# EAGLE design scope (EAGLE 5.01)
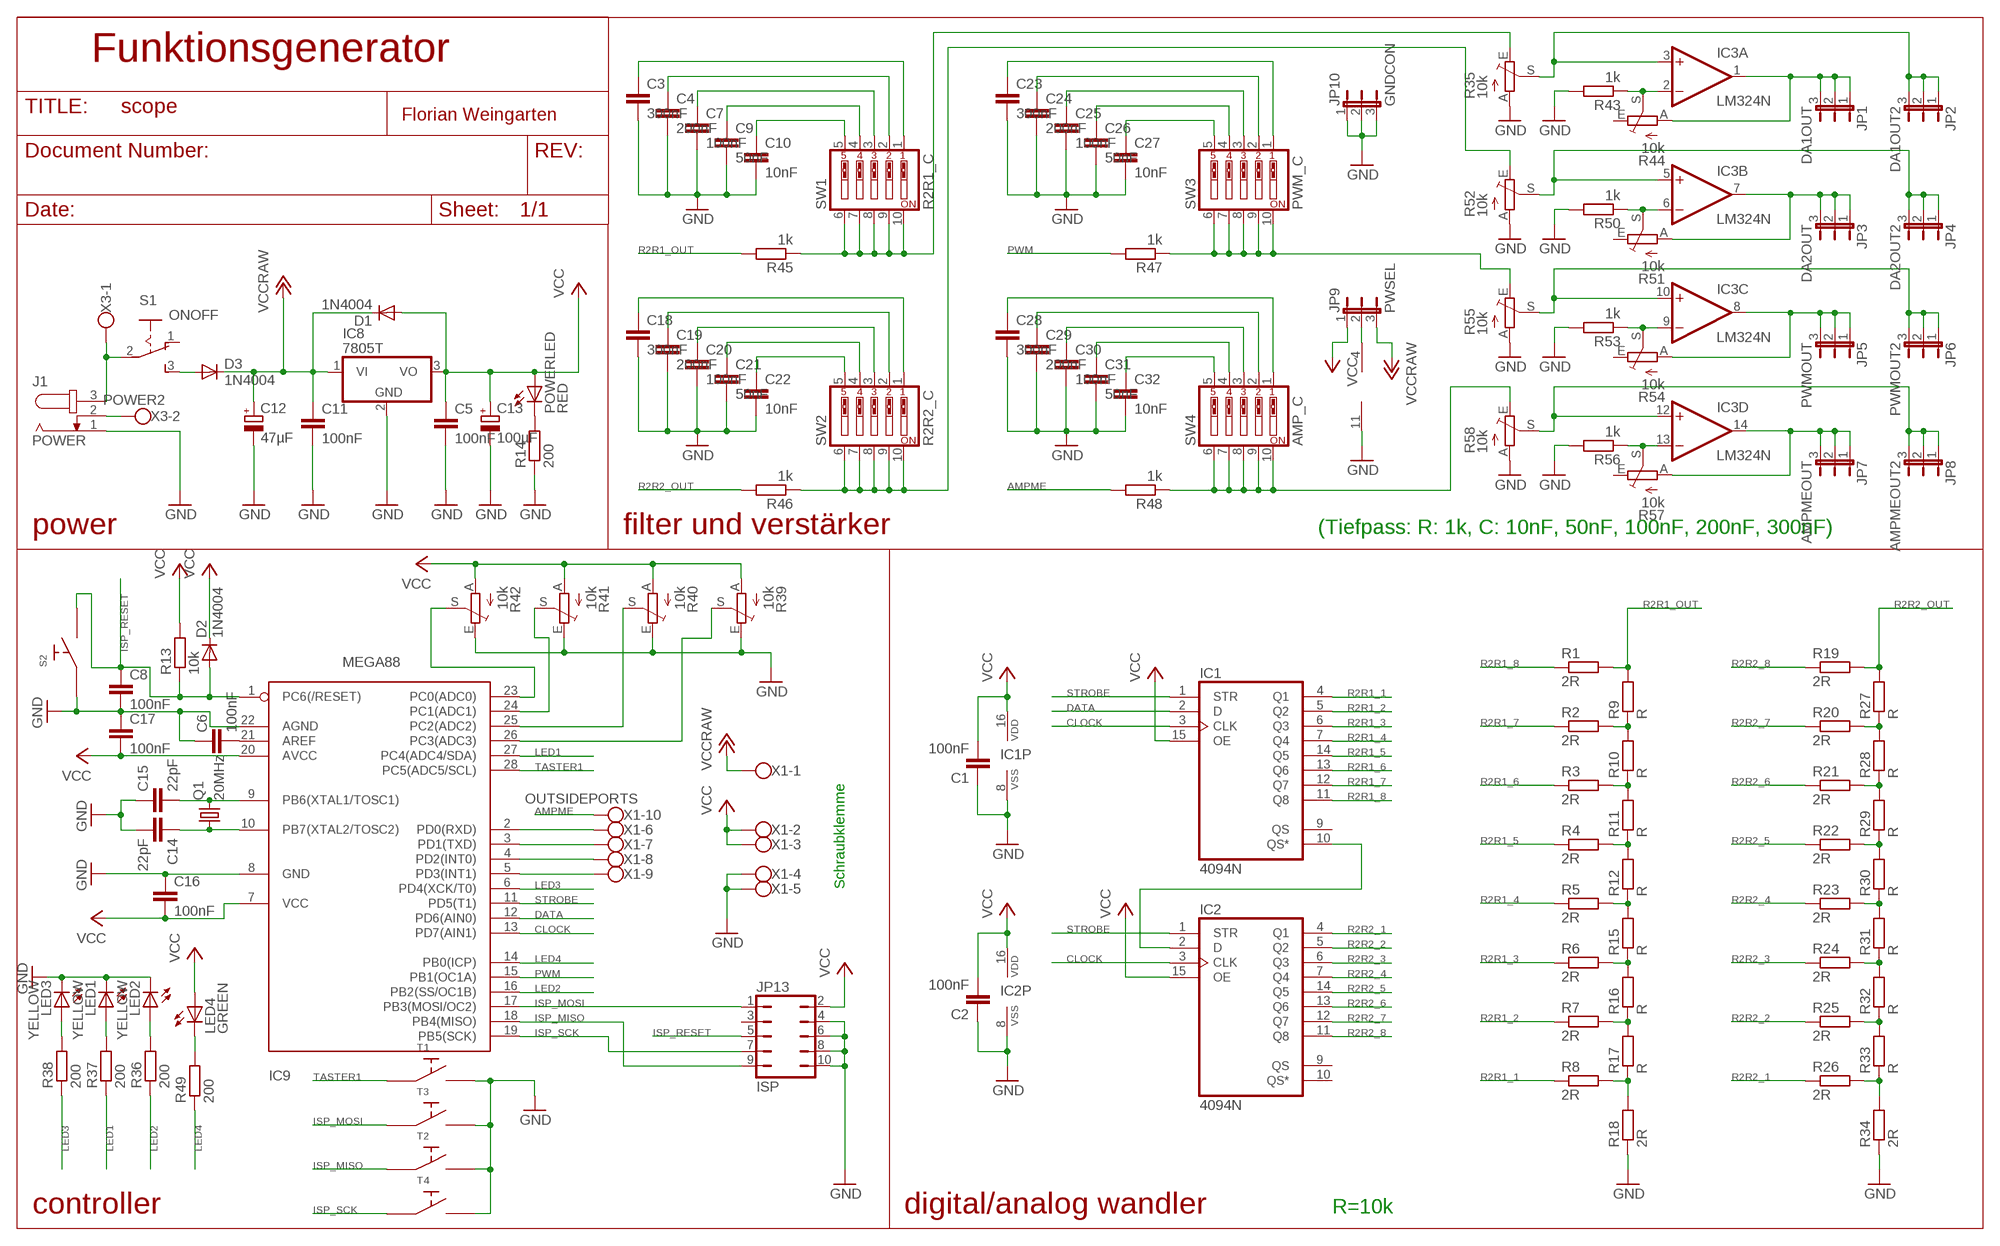
[diagram p0: schematic, sheet 1]

## Parts
C1  100nF  C-EU025-024X044  [C025-024X044]
C2  100nF  C-EU025-024X044  [C025-024X044]
C3  300nF  C-EU025-024X044  [C025-024X044]
C4  200nF  C-EU025-024X044  [C025-024X044]
C5  100nF  C-EU025-024X044  [C025-024X044]
C6  100nF  C-EU025-024X044  [C025-024X044]
C7  100nF  C-EU025-024X044  [C025-024X044]
C8  100nF  C-EU025-024X044  [C025-024X044]
C9  50nF  C-EU025-024X044  [C025-024X044]
C10  10nF  C-EU025-024X044  [C025-024X044]
C11  100nF  C-EU025-024X044  [C025-024X044]
C12  47µF  CPOL-EUE2-5  [E2-5]
C13  100µF  CPOL-EUE2-5  [E2-5]
C14  22pF  C-EU025-025X050  [C025-025X050]
C15  22pF  C-EU025-025X050  [C025-025X050]
C16  100nF  C-EU025-024X044  [C025-024X044]
C17  100nF  C-EU025-024X044  [C025-024X044]
C18  300nF  C-EU025-024X044  [C025-024X044]
C19  200nF  C-EU025-024X044  [C025-024X044]
C20  100nF  C-EU025-024X044  [C025-024X044]
C21  50nF  C-EU025-024X044  [C025-024X044]
C22  10nF  C-EU025-024X044  [C025-024X044]
C23  300nF  C-EU025-024X044  [C025-024X044]
C24  200nF  C-EU025-024X044  [C025-024X044]
C25  100nF  C-EU025-024X044  [C025-024X044]
C26  50nF  C-EU025-024X044  [C025-024X044]
C27  10nF  C-EU025-024X044  [C025-024X044]
C28  300nF  C-EU025-024X044  [C025-024X044]
C29  200nF  C-EU025-024X044  [C025-024X044]
C30  100nF  C-EU025-024X044  [C025-024X044]
C31  50nF  C-EU025-024X044  [C025-024X044]
C32  10nF  C-EU025-024X044  [C025-024X044]
D1  1N4004  DIODE-D-2.5  [D-2.5]
D2  1N4004  DIODE-D-2.5  [D-2.5]
D3  1N4004  DIODE-D-2.5  [D-2.5]
IC1  4094N  [DIL16]
IC2  4094N  [DIL16]
IC3  LM324N  [DIL14]
IC8  7805T  [TO220H]
IC9  MEGA88  MEGA8-P  [DIL28-3]
J1  POWER  JACK-PLUG1  [SPC4078]
JP1  DA1OUT  JP2E  [JP2]
JP2  DA1OUT2  JP2E  [JP2]
JP3  DA2OUT  JP2E  [JP2]
JP4  DA2OUT2  JP2E  [JP2]
JP5  PWMOUT  JP2E  [JP2]
JP6  PWMOUT2  JP2E  [JP2]
JP7  AMPMEOUT  JP2E  [JP2]
JP8  AMPMEOUT2  JP2E  [JP2]
JP9  PWSEL  JP2E  [JP2]
JP10  GNDCON  JP2E  [JP2]
JP13  ISP  JP5Q  [JP5Q]
LED1  YELLOW  LED3MM  [LED3MM]
LED2  YELLOW  LED3MM  [LED3MM]
LED3  YELLOW  LED3MM  [LED3MM]
LED4  GREEN  LED3MM  [LED3MM]
POWERLED  RED  LED3MM  [LED3MM]
Q1  20MHz  CRYSTALHC49S  [HC49/S]
R1  2R  R-EU_0207/2V  [0207/2V]
R2  2R  R-EU_0207/2V  [0207/2V]
R3  2R  R-EU_0207/2V  [0207/2V]
R4  2R  R-EU_0207/2V  [0207/2V]
R5  2R  R-EU_0207/2V  [0207/2V]
R6  2R  R-EU_0207/2V  [0207/2V]
R7  2R  R-EU_0207/2V  [0207/2V]
R8  2R  R-EU_0207/2V  [0207/2V]
R9  R  R-EU_0207/2V  [0207/2V]
R10  R  R-EU_0207/2V  [0207/2V]
R11  R  R-EU_0207/2V  [0207/2V]
R12  R  R-EU_0207/2V  [0207/2V]
R13  10k  R-EU_0207/2V  [0207/2V]
R14  200  R-EU_0207/2V  [0207/2V]
R15  R  R-EU_0207/2V  [0207/2V]
R16  R  R-EU_0207/2V  [0207/2V]
R17  R  R-EU_0207/2V  [0207/2V]
R18  2R  R-EU_0207/2V  [0207/2V]
R19  2R  R-EU_0207/2V  [0207/2V]
R20  2R  R-EU_0207/2V  [0207/2V]
R21  2R  R-EU_0207/2V  [0207/2V]
R22  2R  R-EU_0207/2V  [0207/2V]
R23  2R  R-EU_0207/2V  [0207/2V]
R24  2R  R-EU_0207/2V  [0207/2V]
R25  2R  R-EU_0207/2V  [0207/2V]
R26  2R  R-EU_0207/2V  [0207/2V]
R27  R  R-EU_0207/2V  [0207/2V]
R28  R  R-EU_0207/2V  [0207/2V]
R29  R  R-EU_0207/2V  [0207/2V]
R30  R  R-EU_0207/2V  [0207/2V]
R31  R  R-EU_0207/2V  [0207/2V]
R32  R  R-EU_0207/2V  [0207/2V]
R33  R  R-EU_0207/2V  [0207/2V]
R34  2R  R-EU_0207/2V  [0207/2V]
R35  10k  TRIM_EU-PT10  [PT-10]
R36  200  R-EU_0207/2V  [0207/2V]
R37  200  R-EU_0207/2V  [0207/2V]
R38  200  R-EU_0207/2V  [0207/2V]
R39  10k  TRIM_EU-PT10  [PT-10]
R40  10k  TRIM_EU-PT10  [PT-10]
R41  10k  TRIM_EU-PT10  [PT-10]
R42  10k  TRIM_EU-PT10  [PT-10]
R43  1k  R-EU_0207/2V  [0207/2V]
R44  10k  TRIM_EU-PT10  [PT-10]
R45  1k  R-EU_0207/2V  [0207/2V]
R46  1k  R-EU_0207/2V  [0207/2V]
R47  1k  R-EU_0207/2V  [0207/2V]
R48  1k  R-EU_0207/2V  [0207/2V]
R49  200  R-EU_0207/2V  [0207/2V]
R50  1k  R-EU_0207/2V  [0207/2V]
R51  10k  TRIM_EU-PT10  [PT-10]
R52  10k  TRIM_EU-PT10  [PT-10]
R53  1k  R-EU_0207/2V  [0207/2V]
R54  10k  TRIM_EU-PT10  [PT-10]
R55  10k  TRIM_EU-PT10  [PT-10]
R56  1k  R-EU_0207/2V  [0207/2V]
R57  10k  TRIM_EU-PT10  [PT-10]
R58  10k  TRIM_EU-PT10  [PT-10]
S1  ONOFF  255SB  [255SB]
S2  MIKROTASTER6X6L  [TASTER3301]
SW1  R2R1_C  SW_DIP-5  [EDG-05]
SW2  R2R2_C  SW_DIP-5  [EDG-05]
SW3  PWM_C  SW_DIP-5  [EDG-05]
SW4  AMP_C  SW_DIP-5  [EDG-05]
T1  MIKROTASTER6X6L  [TASTER3301]
T2  MIKROTASTER6X6L  [TASTER3301]
T3  MIKROTASTER6X6L  [TASTER3301]
T4  MIKROTASTER6X6L  [TASTER3301]
X1  OUTSIDEPORTS  W237-10P  [W237-10P]
X3  POWER2  W237-02P  [W237-132]

## Nets
+12V: C11.1 C12.+ D1.C D3.C IC8.1(VI) JP9.3 X1.1 ; supply symbol labelled VCCRAW
AMPME: R48.2 X1.10
CLOCK: IC1.3(CLK) IC2.3(CLK) IC9.13(PD7(AIN1))
DATA: IC1.2(D) IC9.12(PD6(AIN0))
GND: C1.1 C2.1 C3.2 C4.2 C5.2 C6.1 C7.2 C8.2 C9.2 C10.2 C11.2 C12.- C13.- C14.2 C15.1 C16.1 C17.1 C18.2 C19.2 C20.2 C21.2 C22.2 C23.2 C24.2 C25.2 C26.2 C27.2 C28.2 C29.2 C30.2 C31.2 C32.2 IC1.8(VSS) IC2.8(VSS) IC3.11(P:V-) IC8.2(GND) IC9.8(GND) IC9.22(AGND) J1.1 JP10.1 JP10.2 JP10.3 JP13.4 JP13.6 JP13.8 JP13.10 LED1.K(C) LED2.K(C) LED3.K(C) R14.1 R18.1 R34.1 R35.A R39.E R40.E R41.E R42.E R43.2 R50.2 R52.A R53.2 R55.A R56.2 R58.A S2.1 T1.2 T2.2 T3.2 T4.2 X1.4 X1.5
ISP_MISO: IC9.18(PB4(MISO)) JP13.9 T2.1
ISP_MOSI: IC9.17(PB3(MOSI/OC2)) JP13.1 T3.1
ISP_RESET: C8.1 D2.A IC9.1(PC6(/RESET)) JP13.5 R13.1 S2.2
ISP_SCK: IC9.19(PB5(SCK)) JP13.7 T4.1
LED1: IC9.27(PC4(ADC4/SDA)) R37.1
LED2: IC9.16(PB2(SS/OC1B)) R36.1
LED3: IC9.6(PD4(XCK/T0)) R38.1
LED4: IC9.14(PB0(ICP)) R49.1
N$1: R2.2 R9.1 R10.2
N$2: R3.2 R10.1 R11.2
N$3: R4.2 R11.1 R12.2
N$4: R5.2 R12.1 R15.2
N$5: R6.2 R15.1 R16.2
N$6: IC3.3(A:+IN) JP2.1 JP2.2 JP2.3 R35.S
N$7: R7.2 R16.1 R17.2
N$8: IC1.10(QS*) IC2.2(D)
N$9: R8.2 R17.1 R18.2
N$10: R20.2 R27.1 R28.2
N$11: R21.2 R28.1 R29.2
N$12: R22.2 R29.1 R30.2
N$13: IC3.14(D:OUT) JP7.1 JP7.2 JP7.3 R57.A
N$14: R24.2 R31.1 R32.2
N$15: R25.2 R32.1 R33.2
N$16: C10.1 SW1.5
N$17: R26.2 R33.1 R34.2
N$18: C9.1 SW1.4
N$19: C7.1 SW1.3
N$20: C4.1 SW1.2
N$21: C3.1 SW1.1
N$22: IC9.2(PD0(RXD)) X1.6
N$23: IC9.3(PD1(TXD)) X1.7
N$24: IC9.4(PD2(INT0)) X1.8
N$25: IC9.5(PD3(INT1)) X1.9
N$26: POWERLED.K(C) R14.2
N$27: IC9.23(PC0(ADC0)) R42.S
N$28: LED3.A R38.2
N$29: LED1.A R37.2
N$30: LED2.A R36.2
N$31: IC3.2(A:-IN) R43.1 R44.S
N$32: IC3.1(A:OUT) JP1.1 JP1.2 JP1.3 R44.A
N$33: IC9.24(PC1(ADC1)) R41.S
N$35: IC9.26(PC3(ADC3)) R39.S
N$36: LED4.K(C) R49.2
N$37: C22.1 SW2.5
N$38: C21.1 SW2.4
N$39: C20.1 SW2.3
N$40: C19.1 SW2.2
N$41: C18.1 SW2.1
N$42: C27.1 SW3.5
N$43: C26.1 SW3.4
N$44: C25.1 SW3.3
N$45: C24.1 SW3.2
N$46: C23.1 SW3.1
N$47: C32.1 SW4.5
N$48: C31.1 SW4.4
N$49: C30.1 SW4.3
N$50: C29.1 SW4.2
N$51: C28.1 SW4.1
N$52: IC3.6(B:-IN) R50.1 R51.S
N$53: IC3.7(B:OUT) JP3.1 JP3.2 JP3.3 R51.A
N$54: IC3.5(B:+IN) JP4.1 JP4.2 JP4.3 R52.S
N$55: IC3.9(C:-IN) R53.1 R54.S
N$56: IC3.8(C:OUT) JP5.1 JP5.2 JP5.3 R54.A
N$57: IC3.10(C:+IN) JP6.1 JP6.2 JP6.3 R55.S
N$58: IC3.13(D:-IN) R56.1 R57.S
N$59: IC3.12(D:+IN) JP8.1 JP8.2 JP8.3 R58.S
N$61: IC3.4(P:V+) JP9.2
N$62: R35.E R45.1 SW1.6 SW1.7 SW1.8 SW1.9 SW1.10
N$63: R46.1 R52.E SW2.6 SW2.7 SW2.8 SW2.9 SW2.10
N$65: R48.1 R58.E SW4.6 SW4.7 SW4.8 SW4.9 SW4.10
N$68: R47.1 R55.E SW3.6 SW3.7 SW3.8 SW3.9 SW3.10
N$69: J1.3 S1.2(P) X3.1
N$70: J1.2 X3.2
N$71: D3.A S1.3(S)
N$72: IC9.25(PC2(ADC2)) R40.S
N$73: R23.2 R30.1 R31.2
N$75: C15.2 IC9.9(PB6(XTAL1/TOSC1)) Q1.2
N$76: C14.1 IC9.10(PB7(XTAL2/TOSC2)) Q1.1
N$101: C6.2 IC9.21(AREF)
PWM: IC9.15(PB1(OC1A)) R47.2
R2R1_1: IC1.4(Q1) R8.1
R2R1_2: IC1.5(Q2) R7.1
R2R1_3: IC1.6(Q3) R6.1
R2R1_4: IC1.7(Q4) R5.1
R2R1_5: IC1.14(Q5) R4.1
R2R1_6: IC1.13(Q6) R3.1
R2R1_7: IC1.12(Q7) R2.1
R2R1_8: IC1.11(Q8) R1.1
R2R1_OUT: R1.2 R9.2 R45.2
R2R2_1: IC2.4(Q1) R26.1
R2R2_2: IC2.5(Q2) R25.1
R2R2_3: IC2.6(Q3) R24.1
R2R2_4: IC2.7(Q4) R23.1
R2R2_5: IC2.14(Q5) R22.1
R2R2_6: IC2.13(Q6) R21.1
R2R2_7: IC2.12(Q7) R20.1
R2R2_8: IC2.11(Q8) R19.1
R2R2_OUT: R19.2 R27.2 R46.2
STROBE: IC1.1(STR) IC2.1(STR) IC9.11(PD5(T1))
TASTER1: IC9.28(PC5(ADC5/SCL)) T1.1
VCC: C1.2 C2.2 C5.1 C13.+ C16.2 C17.2 D1.A D2.C IC1.15(OE) IC1.16(VDD) IC2.15(OE) IC2.16(VDD) IC8.3(VO) IC9.7(VCC) IC9.20(AVCC) JP9.1 JP13.2 LED4.A POWERLED.A R13.2 R39.A R40.A R41.A R42.A X1.2 X1.3
Unconnected: IC1.9(QS) IC2.9(QS) IC2.10(QS*) JP13.3 R44.E R51.E R54.E R57.E S1.1(O)

## Notes on the sheet
- Funktionsgenerator
- Florian Weingarten
- power | filter und verstärker | (Tiefpass: R: 1k, C: 10nF, 50nF, 100nF, 200nF, 300nF)
- Schraubklemme
- controller | digital/analog wandler | R=10k

## Library data of the parts
C1-C11 C14-C32 = rcl:C-EU: CAPACITOR, European symbol
C12 C13 = rcl:CPOL-EU: POLARIZED CAPACITOR, European symbol
D1-D3 = diode:DIODE-: DIODE
IC1 IC2 = 40xx:4094: 8-stage SHIFT/STORE REGISTER, tri-state
IC3 = linear:LM324: OP AMP
IC8 = linear:78*: Positive VOLTAGE REGULATOR Source: http://cache.national.com/ds/LM/LM78L05.pdf http://www.fairchildsemi.com/ds/LM/LM7805.pdf
IC9 = atmel:MEGA8-P: MICROCONTROLLER 8 Kbytes FLASH, 1 kbytes SRAM, 512 bytes EEPROM, USART, 4-channel 10 bit ADC, 2-channel 8 bit ADC Pin compatible with Atmega48, ATMega88, ATMega168 Source: avr.lbr
J1 = con-jack:JACK-PLUG: DC POWER JACK Power Jack, DC, Right Angle, Through Hole, Rated 5A at 16VDC, PC Terminals Distributor: Farnell (www.Farnell.de) Drawing: 84N1161.pdf / 84N1162.pdf Manufacturer: SPC Technology (www.spctechnology.com) Type: SPC4077 / SPC 4078
JP1-JP10 = jumper:JP2E: JUMPER
JP13 = jumper:JP5Q: JUMPER
LED1-LED4 POWERLED = led:LED: LED OSRAM: - CHIPLED LG R971, LG N971, LY N971, LG Q971, LY Q971, LO R971, LY R971 LH N974, LH R974 LS Q976, LO Q976, LY Q976 LO Q996 - Hyper CHIPLED LW Q18S LB Q993, LB Q99A, LB R99A - SideLED LS A670, LO A670, LY A670, LG A670, LP A670 LB A673, LV A673, LT A673, LW A673 LH A674 LY A675 LS A676, LA A676, LO A676, LY A676, LW A676 LS A679, LY A679, LG A679 - Hyper Micro SIDELED® LS Y876, LA Y876, LO Y876, LY Y876 LT Y87S - SmartLED LW L88C, LW L88S LB L89C, LB L89S, LG L890 LS L89K, LO L89K, LY L89K LS L896, LA L896, LO L896, LY L896 - TOPLED LS T670, LO T670, LY T670, LG T670, LP T670 LSG T670, LSP T670, LSY T670, LOP T670, LYG T670 LG T671, LOG T671, LSG T671 LB T673, LV T673, LT T673, LW T673 LH T674 LS T676, LA T676, LO T676, LY T676, LB T676, LH T676, LSB T676, LW T676 LB T67C, LV T67C, LT T67C, LS T67K, LO T67K, LY T67K, LW E67C LS E67B, LA E67B, LO E67B, LY E67B, LB E67C, LV E67C, LT E67C LW T67C LS T679, LY T679, LG T679 LS T770, LO T770, LY T770, LG T770, LP T770 LB T773, LV T773, LT T773, LW T773 LH T774 LS E675, LA E675, LY E675, LS T675 LS T776, LA T776, LO T776, LY T776, LB T776 LHGB T686 LT T68C, LB T68C - Hyper Mini TOPLED® LB M676 - Mini TOPLED Santana® LG M470 LS M47K, LO M47K, LY M47K Source: http://www.osram.convergy.de - LUMILED® LXK2-PW12-R00, LXK2-PW12-S00, LXK2-PW14-U00, LXK2-PW14-V00 LXK2-PM12-R00, LXK2-PM12-S00, LXK2-PM14-U00 LXK2-PE12-Q00, LXK2-PE12-R00, LXK2-PE12-S00, LXK2-PE14-T00, LXK2-PE14-U00 LXK2-PB12-K00, LXK2-PB12-L00, LXK2-PB12-M00, LXK2-PB14-N00, LXK2-PB14-P00, LXK2-PB14-Q00 LXK2-PR12-L00, LXK2-PR12-M00, LXK2-PR14-Q00, LXK2-PR14-R00 LXK2-PD12-Q00, LXK2-PD12-R00, LXK2-PD12-S00 LXK2-PH12-R00, LXK2-PH12-S00 LXK2-PL12-P00, LXK2-PL12-Q00, LXK2-PL12-R00 Source: www.luxeon.com
Q1 = crystal:CRYSTAL: CRYSTAL
R1-R34 R36-R38 R43 R45-R50 R53 R56 = rcl:R-EU_: RESISTOR, European symbol
R35 R39-R42 R44 R51 R52 R54 R55 R57 R58 = pot:TRIM_EU-: POTENTIOMETER
S1 = switch:255SB: SLIDING SWITCH Distributor Buerklin, 11G810
S2 T1-T4 = reichelt:MIKROTASTER
SW1-SW4 = special:SW_DIP-5: DIP SWITCH
X1 = con-wago-508:W237-10P: WAGO SREW CLAMP
X3 = con-wago-508:W237-02P: WAGO SREW CLAMP

## Board
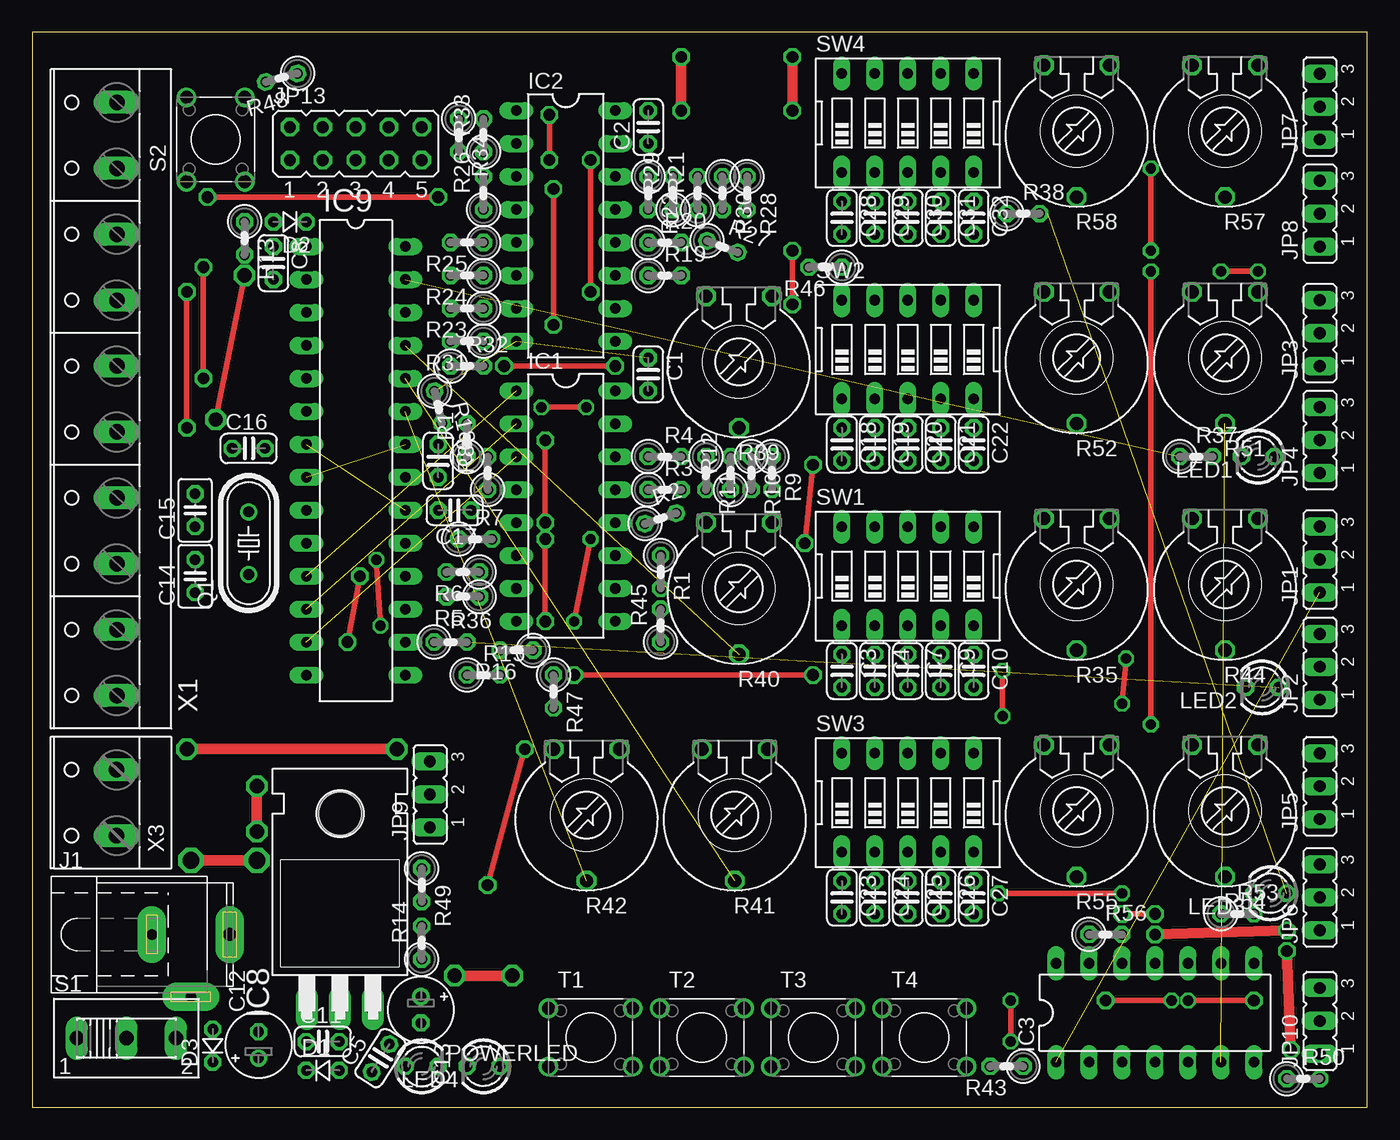
[diagram p1: board, top side]
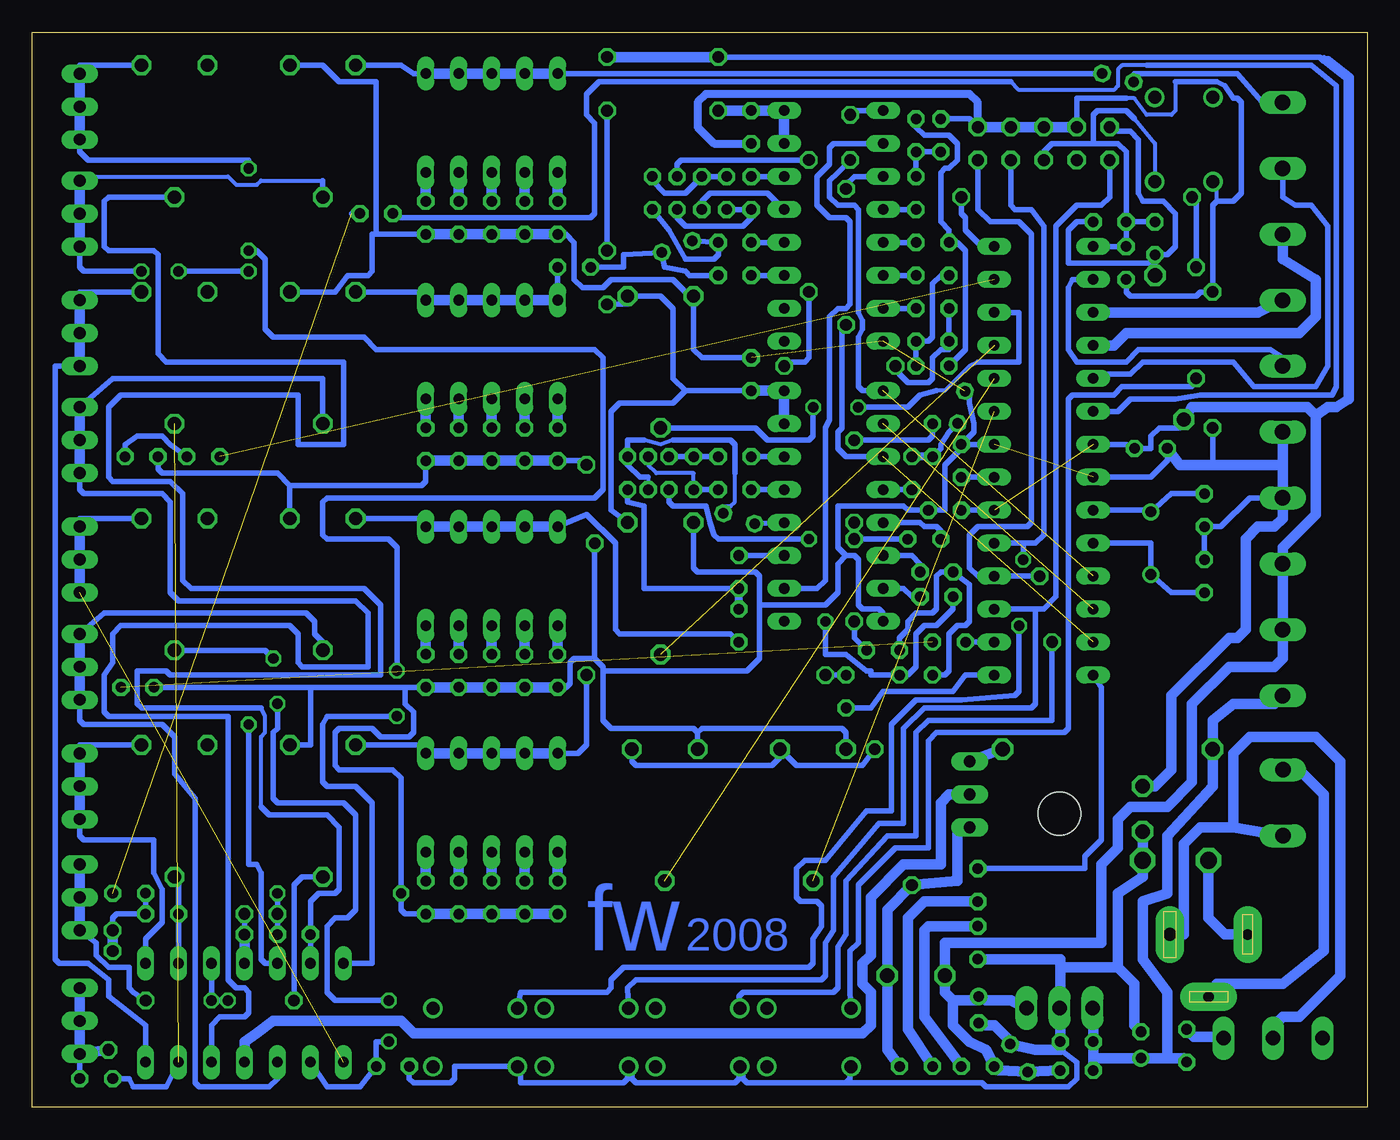
[diagram p2: board, bottom side, seen from below]

Size 102.86 x 82.86 mm. Coordinates in mm from the lower left corner, seen from the top.
Outline: 0,0 102.86,0 102.86,82.86 0,82.86 0,0
Copper layers (1*16): Top 0.035mm / dielectric 1.5mm / Bottom 0.035mm
Design rules "default": minimum track width 10mil, minimum drill 24mil, track to track 8mil, track to pad 8mil, pad to pad 8mil, via to via 8mil, smd to smd 8mil, copper to edge 40mil, drill to drill 8mil, minimum pad ring 10mil, minimum via ring 8mil, stop-mask expansion 4mil, vias tented up to drill 0mil, thermal gap 10mil

### Footprints (pad centres in the part's own frame; a part is rotated, then mirrored left to right if it is on the bottom)
C025-024X044 = drill 0.813 octagon: 1 -1.27,0; 2 1.27,0
E2-5 = drill 0.813 pad 1.27 round: + -1.016,0 | drill 0.813 pad 1.27 octagon: - 1.016,0
C025-025X050 = drill 0.813 octagon: 1 -1.27,0; 2 1.27,0
D-2.5 = drill 0.813 octagon: A 1.27,0; C -1.27,0
DIL16 = drill 0.813 long: 1 -8.89,-3.81; 2 -6.35,-3.81; 3 -3.81,-3.81; 4 -1.27,-3.81; 5 1.27,-3.81; 6 3.81,-3.81; 7 6.35,-3.81; 8 8.89,-3.81; 9 8.89,3.81; 10 6.35,3.81; 11 3.81,3.81; 12 1.27,3.81; 13 -1.27,3.81; 14 -3.81,3.81; 15 -6.35,3.81; 16 -8.89,3.81
DIL14 = drill 0.813 long: 1 -7.62,-3.81; 2 -5.08,-3.81; 3 -2.54,-3.81; 4 0,-3.81; 5 2.54,-3.81; 6 5.08,-3.81; 7 7.62,-3.81; 8 7.62,3.81; 9 5.08,3.81; 10 2.54,3.81; 11 0,3.81; 12 -2.54,3.81; 13 -5.08,3.81; 14 -7.62,3.81
TO220H = drill 1.118 long: 1 -2.54,-10.16; 2 0,-10.16; 3 2.54,-10.16 | hole 3.302: 0,4.826
DIL28-3 = drill 0.813 long: 1 -16.51,-3.81; 2 -13.97,-3.81; 3 -11.43,-3.81; 4 -8.89,-3.81; 5 -6.35,-3.81; 6 -3.81,-3.81; 7 -1.27,-3.81; 8 1.27,-3.81; 9 3.81,-3.81; 10 6.35,-3.81; 11 8.89,-3.81; 12 11.43,-3.81; 13 13.97,-3.81; 14 16.51,-3.81; 15 16.51,3.81; 16 13.97,3.81; 17 11.43,3.81; 18 8.89,3.81; 19 6.35,3.81; 20 3.81,3.81; 21 1.27,3.81; 22 -1.27,3.81; 23 -3.81,3.81; 24 -6.35,3.81; 25 -8.89,3.81; 26 -11.43,3.81; 27 -13.97,3.81; 28 -16.51,3.81
SPC4078 = drill 0.8 pad 2.184 long: 1 -3,0; 2 0,-4.8 | drill 1 pad 2.184 long: 3 3,0
JP2 = drill 0.914 long: 1 -2.54,0; 2 0,0; 3 2.54,0
JP5Q = drill 0.914 octagon: 1 -5.08,-1.27; 2 -5.08,1.27; 3 -2.54,-1.27; 4 -2.54,1.27; 5 0,-1.27; 6 0,1.27; 7 2.54,-1.27; 8 2.54,1.27; 9 5.08,-1.27; 10 5.08,1.27
LED3MM = drill 0.813 octagon: A -1.27,0; K 1.27,0
HC49/S = drill 0.813 round: 1 -2.413,0; 2 2.413,0
0207/2V = drill 0.813 octagon: 1 -1.27,0; 2 1.27,0
PT-10 = drill 1.016 octagon: A -2.54,-5.08; E 2.54,-5.08; S 0,5.08
255SB = drill 1.118 long: 1 -3.81,0; 2 0,0; 3 3.81,0
TASTER3301 = drill 1 round: 1 -3.25,2.25; 2 -3.25,-2.25; 3 3.25,-2.25; 4 3.25,2.25
EDG-05 = drill 0.813 long: 1 -5.08,-3.81; 2 -2.54,-3.81; 3 0,-3.81; 4 2.54,-3.81; 5 5.08,-3.81; 6 5.08,3.81; 7 2.54,3.81; 8 0,3.81; 9 -2.54,3.81; 10 -5.08,3.81
W237-10P = drill 1.194 long: 1 -22.86,-0.635; 2 -17.78,-0.635; 3 -12.7,-0.635; 4 -7.62,-0.635; 5 -2.54,-0.635; 6 2.54,-0.635; 7 7.62,-0.635; 8 12.7,-0.635; 9 17.78,-0.635; 10 22.86,-0.635
W237-132 = drill 1.194 long: 1 -2.54,-0.635; 2 2.54,-0.635

### Placement (x,y rotation side)
C1  47.46,56.51 270 top
C2  47.46,75.56 90 top
C3  62.38,33.65 270 top
C4  64.92,33.65 270 top
C5  26.82,3.8 57.7 top
C6  31.27,49.84 270 top
C7  67.46,33.65 270 top
C8  18.57,65.08 270 top
C9  70,33.65 270 top
C10  72.54,33.65 270 top
C11  22.38,5.07 0 top
C12  17.42,4.82 90 top
C13  29.94,7.53 270 top
C14  12.54,40.95 90 top
C15  12.54,46.03 90 top
C16  16.66,50.8 0 top
C17  32.54,46.03 180 top
C18  62.38,51.11 270 top
C19  64.92,51.11 270 top
C20  67.46,51.11 270 top
C21  70,51.11 270 top
C22  72.54,51.11 270 top
C23  62.38,16.19 270 top
C24  64.92,16.19 270 top
C25  67.46,16.19 270 top
C26  70,16.19 270 top
C27  72.54,16.19 270 top
C28  62.38,68.58 270 top
C29  64.92,68.58 270 top
C30  67.46,68.58 270 top
C31  70,68.58 270 top
C32  72.54,68.58 270 top
D1  22.38,2.85 0 top
D2  19.84,68.26 180 top
D3  13.89,4.75 90 top
IC1  41.11,46.35 270 top
IC2  41.11,67.94 270 top
IC3  86.51,7.3 0 top
IC8  23.7,17.83 0 top
IC9  24.92,49.84 270 top
J1  12.21,13.33 0 top
JP1  99.21,42.22 90 top
JP2  99.21,33.97 90 top
JP3  99.21,59.68 90 top
JP4  99.21,51.43 90 top
JP5  99.21,24.76 90 top
JP6  99.21,16.19 90 top
JP7  99.21,77.15 90 top
JP8  99.21,68.89 90 top
JP9  30.63,24.12 90 top
JP10  99.21,6.66 90 top
JP13  24.92,74.29 0 top
LED1  94.45,50.16 180 top
LED2  94.77,32.38 180 top
LED3  95.4,16.5 180 top
LED4  34.76,3.17 180 top
POWERLED  30,3.17 0 top
Q1  16MHz  [HC49/S]  16.66,43.49 90 top
R1  48.41,41.27 270 top
R2  48.41,45.4 18.5 top
R3  48.73,47.62 0 top
R4  48.73,50.16 0 top
R5  33.17,39.37 180 top
R6  33.17,41.27 180 top
R7  34.12,43.81 0 top
R8  35.08,48.89 90 top
R9  56.98,48.89 270 top
R10  55.4,48.89 270 top
R11  51.91,48.89 270 top
R12  53.81,48.89 90 top
R13  16.34,66.99 270 top
R14  30,12.7 90 top
R15  34.76,33.33 0 top
R16  37.3,35.24 180 top
R17  33.49,51.43 90 top
R18  31.27,53.97 282.6 top
R19  48.73,64.13 0 top
R20  48.73,66.67 0 top
R21  51.27,70.48 90 top
R22  47.46,70.48 270 top
R23  33.49,61.59 180 top
R24  33.49,64.13 180 top
R25  33.49,66.67 180 top
R26  34.76,70.48 90 top
R27  53.17,66.35 339 top
R28  55.08,70.48 270 top
R29  49.37,70.48 90 top
R30  53.17,70.48 270 top
R31  33.49,59.05 180 top
R32  33.49,57.14 0 top
R33  34.76,74.93 90 top
R34  32.86,74.93 270 top
R35  80.48,40.32 180 top
R36  32.22,35.87 0 top
R37  89.69,50.16 0 top
R38  76.35,68.89 0 top
R39  54.45,57.46 180 top
R40  54.45,40 180 top
R41  54.13,22.54 180 top
R42  42.7,22.54 180 top
R43  75.08,3.17 180 top
R44  91.91,40.32 180 top
R45  48.41,37.14 90 top
R46  61.11,64.77 180 top
R47  40.16,32.06 270 top
R48  19.2,79.37 195.3 top
R49  30,17.14 270 top
R50  97.94,2.22 0 top
R51  91.91,57.78 180 top
R52  80.48,57.78 180 top
R53  92.86,14.92 0 top
R54  91.91,22.85 180 top
R55  80.48,22.85 180 top
R56  82.7,13.33 0 top
R57  91.91,75.24 180 top
R58  80.48,75.24 180 top
S1  7.24,5.34 0 top
S2  14.12,74.61 90 top
SW1  67.46,40.95 0 top
SW2  67.46,58.41 0 top
SW3  67.46,23.49 0 top
SW4  67.46,75.88 0 top
T1  43.02,5.39 0 top
T2  51.59,5.39 0 top
T3  60.16,5.39 0 top
T4  68.73,5.39 0 top
X1  5.87,54.6 90 top
X3  5.86,23.49 90 top

### Tracks (layer width: path | path; a pad name or v marks a point on that pad's centre or on a via)
+12V  (via drill 1.1)
  Top 0.813: v11.9,27.62 v28.09,27.62
  Bottom 0.813: IC8.1 21.11,6.98 21.11,4.44 | 21.11,4.44 C11.1 | 21.11,3.8 D1.C | 21.11,3.8 21.11,4.44 | 21.11,3.8 C12.+ arc-63 17.3,3.8 15.39,3.8 | X1.1 7.14,31.11 10.31,31.11 11.9,29.84 v11.9,27.62 11.9,24.76 15.39,20.95 15.39,16.5 17.3,15.87 17.3,11.43 15.39,8.88 15.39,3.8 | D3.C 14.12,3.8 15.39,3.8 | v28.09,27.62 JP9.3
AMPME
  Bottom 0.406: X1.10 8.09,77.47 9.99,79.69 17.93,79.69 R48.2
CLOCK  (via drill 0.9)  (1 unrouted)
  Top 0.406: v40.16,60.32 v40.16,70.8
  Bottom 0.406: IC1.3 40.16,50.16 40.79,50.8 40.79,52.06 40.48,52.38 40.48,53.02 40.48,60 v40.16,60.32 | v40.16,70.8 40.16,71.12 39.52,71.75 IC2.3
DATA  (1 unrouted)
GND  (via drill 0.8, 0.9, 1.1, 1.3)  (3 unrouted)
  Top 0.406: v83.97,14.92 v86.51,14.92 | v11.9,52.38 v11.9,62.86 | v59.52,43.49 v60.16,49.52 | v74.45,16.5 v83.97,16.5
  Top 0.813: v12.22,19.04 v17.3,19.04 | v17.3,21.27 v17.3,24.76 | v86.51,13.33 v96.67,13.65 | v96.67,12.06 v96.99,4.44
  Bottom 0.305: 11.58,69.84 11.58,71.12 S2.1 | 18.57,77.78 17.93,77.78 16.98,76.51 15.07,76.51 14.76,76.83 14.76,79.05 | 9.36,13.33 9.04,13.33
  Bottom 0.406: C14.2 C15.1 11.26,44.76 9.04,46.98 X1.4 | IC9.8 16.66,48.57 15.39,49.84 C16.1 | C6.1 IC9.22 | C6.1 31.27,50.8 32.54,49.52 32.54,46.03 C17.1 35.39,46.03 35.71,46.35 40.79,46.35 40.79,43.17 40.16,42.54 | JP13.4 22.38,77.78 18.57,77.78 | T1.2 39.84,2.54 39.84,2.22 40.16,1.9 | 40.16,1.9 47.78,1.9 48.09,2.22 48.09,2.85 T2.2 48.41,2.54 48.41,2.22 48.73,1.9 56.35,1.9 56.67,2.22 56.67,2.85 T3.2 56.98,2.22 57.3,1.9 65.24,1.9 65.24,3.17 | 65.24,3.17 T4.2 | R56.2 v83.97,14.92 v83.97,16.5 | v86.51,14.92 v86.51,13.33 | v96.67,13.65 96.67,14.6 96.36,14.92 R53.2 LED3.K | JP10.1 R50.2 | R43.2 73.81,2.22 73.5,1.9 70.64,1.9 70.32,2.22 70.32,3.17 65.24,3.17 | JP13.10 30.63,76.2 R34.1 | 11.9,49.52 v11.9,52.38 | C8.2 18.57,62.86 18.25,62.54 13.17,62.54 12.85,62.86 v11.9,62.86 11.9,69.53 11.58,69.84 10.31,69.84 9.68,70.48 9.68,77.47 9.99,77.78 10.31,77.78 10.95,78.73 11.58,79.05 14.76,79.05 | 23.65,4.44 22.38,3.49 22.38,2.22 23.01,1.58 29.36,1.58 29.68,1.9 40.16,1.9 | 40.16,42.54 39.52,42.54 39.2,42.22 39.2,38.73 38.89,38.41 37.62,38.41 37.3,38.09 IC1.8 | R18.1 30.63,55.24 30.63,54.29 30.31,52.7 30.31,52.06 C6.1 | R52.A 79.53,62.86 78.58,64.13 76.99,64.13 76.67,64.45 76.67,67.31 76.35,67.31 | C28.2 61.75,67.31 61.11,66.67 61.11,63.81 60.48,63.18 58.89,63.18 58.26,63.81 53.49,63.81 52.22,62.54 R39.E 51.91,58.41 51.27,57.78 C1.1 | R42.E 40.16,28.89 40.48,29.2 51.27,29.2 51.59,28.89 | 51.59,28.89 R41.E | 51.59,28.89 51.91,29.2 58.26,29.2 58.89,29.84 58.89,33.65 | 58.89,33.65 58.89,33.97 59.52,34.6 | 59.52,34.6 61.11,34.6 61.43,34.28 61.43,32.7 61.75,32.38 C3.2 | C22.2 72.54,48.25 72.86,47.94 83.02,47.94
  Bottom 0.406: C18.2 60.16,49.84 v60.16,49.52 | 59.52,34.6 v59.52,43.49 | R40.E 51.91,41.59 51.59,41.27 47.14,41.27 46.83,40.95 46.83,38.73 | 46.83,38.73 46.83,34.6 47.78,33.65 58.89,33.65 | 40.16,42.54 40.79,41.91 40.79,39.68 41.74,38.73 46.83,38.73 | C10.2 74.13,32.38 | 74.13,32.38 81.43,32.38 | 81.43,32.38 LED2.K | 83.02,47.94 R35.A | 83.02,47.94 83.97,48.89 92.86,48.89 93.18,49.21 LED1.K | C32.2 76.35,67.31 | 76.35,67.31 76.35,79.05 79.21,79.05 80.48,80.32 R58.A | C27.2 74.13,14.92 74.45,15.24 v74.45,16.5 74.45,25.39 75.08,26.03 79.21,26.03 79.53,26.35 79.53,28.89 79.21,29.2 76.67,29.2 76.03,28.57 73.81,28.57 73.5,28.89 73.5,30.47 74.13,31.11 74.13,32.38 | R55.A 81.43,27.93 81.43,32.38
  Bottom 0.61: C2.1 50.32,74.29 51.59,75.56 51.59,77.47 50.95,78.1 30.63,78.1 30,77.47 JP13.10
  Bottom 0.813: 23.65,7.62 C11.2 23.65,4.44 25.55,4.44 C5.2 27.46,5.07 28.73,6.35 29.36,6.35 C13.- | R14.1 23.65,11.43 23.65,10.79 | 23.65,7.62 IC8.2 | 23.65,10.79 23.65,7.62 | C12.- 17.93,6.35 17.93,9.52 19.2,10.79 | 19.2,10.79 23.65,10.79 | 6.5,49.52 X1.4 6.5,45.4 7.14,44.76 8.41,44.76 9.36,43.81 9.36,36.82 9.99,36.19 10.63,36.19 15.07,31.74 15.07,26.03 16.34,24.76 v17.3,24.76 | 6.5,49.52 X1.5 | 9.04,13.33 J1.1 9.36,13.33 10.95,13.33 12.22,14.6 v12.22,19.04 | 19.2,10.79 19.2,16.5 17.3,17.77 v17.3,19.04 v17.3,21.27 | 6.5,49.52 11.9,49.52 14.44,49.52 C16.1 | JP13.4 JP13.6 JP13.8 JP13.10 | C18.2 C19.2 C20.2 C21.2 C22.2 | C28.2 C29.2 C30.2 C31.2 C32.2 | C3.2 C4.2 C7.2 C9.2 C10.2 | C23.2 C24.2 C25.2 C26.2 C27.2 | JP10.3 JP10.2 JP10.1 v96.99,4.44 | v96.67,13.65 v96.67,12.06 | v86.51,13.33 IC3.11
ISP_MISO  (via drill 0.9)
  Top 0.406: v24.28,35.87 v25.23,40.95
  Bottom 0.406: JP13.9 30,69.21 29.04,68.26 26.82,68.26 25.87,67.31 25.87,45.08 26.19,44.76 30,44.76 30.63,44.13 30.63,41.59 30,40.95 IC9.18 v25.23,40.95 | v24.28,35.87 24.28,29.84 33.81,29.84 34.76,28.89 34.76,20.95 36.98,20.95 40.16,17.46 40.16,13.33 40.79,12.38 40.79,9.2 41.11,8.88 48.09,8.88 48.41,8.57 T2.1
ISP_MOSI
  Bottom 0.406: 25.55,38.41 24.92,38.41 23.97,39.37 23.97,67.94 22.38,69.53 20.47,69.53 19.84,70.16 JP13.1 | 25.55,38.41 IC9.17 | 25.55,38.41 25.55,31.11 25.87,30.79 34.13,30.79 35.71,29.2 35.71,21.9 37.62,21.9 41.11,17.77 41.11,13.65 41.74,12.7 41.74,10.16 42.06,9.84 56.35,9.84 56.98,9.2 T3.1
ISP_RESET
  Bottom 0.305: 17.93,76.2 16.34,74.29 16.34,71.43 S2.2
  Bottom 0.406: IC9.1 C8.1 D2.A | R13.1 D2.A | D2.A 18.57,73.66 19.2,74.29 21.11,74.29 | 21.11,74.29 24.28,74.29 24.92,73.66 JP13.5 | 17.93,76.2 18.57,76.83 20.79,76.83 21.11,76.51 21.11,74.29
ISP_SCK  (via drill 0.8)
  Top 0.406: v26.82,37.14 v26.5,42.22
  Bottom 0.406: 26.5,43.49 25.55,43.49 24.92,44.13 24.92,67.94 25.87,69.21 27.14,69.21 27.46,69.53 JP13.7 | 26.5,43.49 IC9.19 | v26.5,42.22 26.5,43.49 | v26.82,37.14 26.82,32.06 27.14,31.74 31.27,31.43 34.76,31.43 36.66,29.52 36.66,22.85 38.57,22.85 41.74,19.04 43.33,19.04 43.97,18.41 43.97,16.19 43.65,15.87 42.38,15.87 42.06,15.55 42.06,13.96 42.7,13.01 42.7,11.11 43.02,10.79 57.3,10.79 58.26,9.84 58.26,9.2 58.57,8.88 65.24,8.88 T4.1
LED1  (1 unrouted)
LED2
  Bottom 0.406: IC9.16 R36.1
LED3
  Bottom 0.305: 16.98,80.32 18.88,80.32 19.2,80.01 19.2,78.73 19.52,78.42 26.82,78.42 27.46,79.05 | 74.45,68.58 74.77,68.58 74.77,68.89 R38.1
  Bottom 0.406: 74.45,68.58 59.84,68.58 59.52,68.89 59.52,75.88 60.16,76.51 60.16,78.1 59.21,79.05 27.46,79.05 | IC9.6 19.2,53.65 18.25,54.6 14.76,54.6 12.85,54.92 2.69,54.92 2.38,55.56 2.38,78.73 4.28,80.32 16.98,80.32
LED4
  Bottom 0.406: R49.1 21.74,18.41 21.74,19.36 20.47,20.63 20.47,32.38 IC9.14
N$1
  Bottom 0.305: 55.4,48.57 R10.2 | 48.73,48.89 48.73,46.67 49.05,46.35 49.68,46.35 50,46.03 R2.2 | 53.49,51.43 54.45,51.11 55.71,51.43
  Bottom 0.406: 55.4,48.57 56.03,48.57 56.98,49.52 R9.1 56.98,51.43 55.71,51.43 | 48.73,48.89 48.73,51.11 49.05,51.43 53.49,51.43
N$2
  Bottom 0.305: R11.2 51.91,48.89 54.76,48.89 55.4,49.52 R10.1
  Bottom 0.406: R3.2 R11.2
N$3
  Bottom 0.406: R4.2 R11.1 R12.2
N$4  (via drill 0.8)
  Top 0.406: v41.74,37.46 v43.02,43.81
  Bottom 0.406: R5.2 31.9,38.41 33.17,37.14 34.13,37.14 34.76,36.51 34.76,33.97 35.39,33.33 R15.2 38.25,33.33 38.25,33.65 38.57,33.65 40.16,34.92 41.74,34.92 v41.74,37.46 | v43.02,43.81 50,43.81 50.32,44.13 50.63,45.08 50.95,46.35 53.49,46.35 53.81,46.67 R12.1
N$5
  Bottom 0.406: R15.1 32.54,33.33 32.22,33.65 32.22,36.51 31.59,37.14 30.95,37.14 30.63,37.46 30.63,40.32 R6.2 32.86,41.27 33.17,40.95 33.17,38.41 33.49,38.09 34.76,38.09 35.39,37.46 35.39,36.82 36.03,36.19 R16.2
N$6
  Bottom 0.406: R35.S 80.48,35.87 81.11,36.51 81.11,37.46 81.75,38.09 97.31,38.09 JP2.3 | IC3.3 83.97,2.22 84.61,1.58 90,1.58 90.32,1.9 90.32,23.81 91.91,25.71 91.91,28.57 92.86,29.52 98.89,29.52 99.21,29.84 JP2.1
  Bottom 0.813: JP2.3 JP2.2 JP2.1
N$7  (via drill 0.9)
  Top 0.406: v39.52,37.46 v39.52,43.81 | v39.52,45.08 v39.52,51.43
  Bottom 0.406: R7.2 v39.52,43.81 v39.52,45.08 | R16.1 39.52,36.19 v39.52,37.46 | R17.2 33.49,51.75 33.81,51.43 38.89,51.43 v39.52,51.43
N$8
  Bottom 0.406: IC2.2 41.11,74.29 41.43,73.97 41.43,72.7 42.38,71.75 42.38,69.53 41.43,68.58 40.16,68.58 39.84,68.26 39.84,61.91 40.16,61.59 40.79,61.59 41.43,60.95 41.43,53.02 41.74,52.38 41.74,40.63 42.38,40 IC1.10
N$9
  Bottom 0.406: R17.1 32.86,50.8 32.86,51.11 32.22,52.06 R18.2
  Bottom 0.61: R17.1 R8.2
N$10
  Bottom 0.406: R27.1 R20.2 50,65.72 50.32,65.4 52.54,65.4 53.81,67.62 R28.2
N$11
  Bottom 0.406: R28.1 55.08,71.43 54.13,70.48 52.54,70.48 R21.2 R29.2
N$12
  Bottom 0.406: R30.2 53.17,68.58 52.54,67.94 48.09,67.94 47.46,68.58 R22.2 R29.1
N$13  (via drill 0.8)
  Top 0.406: v86.19,66.04 v86.19,72.39 | v74.77,30.16 v74.77,33.65
  Bottom 0.406: R57.A 99.21,80.32 JP7.3 | JP7.1 99.21,73.66 98.58,73.02 86.19,73.02 v86.19,72.39 | IC3.14 76.67,11.11 76.67,23.49 77.94,24.76 80.16,24.76 80.48,25.08 80.48,29.52 80.16,30.16 v74.77,30.16 | v74.77,33.65 74.77,43.17 75.4,43.81 80.16,43.81 80.48,44.13 80.48,46.67 80.16,46.98 59.52,46.98 58.89,47.62 58.89,57.78 59.52,58.41 76.35,58.41 77.3,59.37 84.29,59.37 84.92,60 84.92,65.4 85.56,66.04 v86.19,66.04
  Bottom 0.813: JP7.1 JP7.2 JP7.3
N$14
  Bottom 0.406: R32.2 R31.1 33.81,59.05 33.49,59.37 33.49,63.49 32.86,64.13 R24.2
N$15
  Bottom 0.406: R33.2 34.76,75.56 34.13,74.93 32.22,74.93 31.59,74.29 31.59,73.02 32.22,72.39 32.54,72.39 32.86,72.07 32.86,68.26 32.22,67.62 R25.2 31.59,66.67 30.95,66.04 30.95,58.41 R32.1
N$16
  Bottom 0.813: C10.1 SW1.5
N$17
  Bottom 0.406: R34.2 R33.1 R26.2
N$18
  Bottom 0.813: C9.1 SW1.4
N$19
  Bottom 0.813: C7.1 SW1.3
N$20
  Bottom 0.813: C4.1 SW1.2
N$21
  Bottom 0.813: C3.1 SW1.1
N$22
  Bottom 0.406: X1.6 6.5,57.78 7.45,58.41 17.61,58.41 18.57,57.46 22.38,57.46 23.01,58.41 23.01,63.18 22.7,63.81 IC9.2
N$23
  Bottom 0.813: X1.7 8.41,61.27 IC9.3
N$24
  Bottom 0.813: IC9.4 19.52,58.73 18.57,59.68 5.23,59.68 3.96,60.95 3.96,63.81 6.5,65.4 X1.8
N$25
  Bottom 0.406: X1.9 6.5,70.16 5.55,69.53 4.28,69.53 3.01,67.94 3.01,57.14 3.96,55.56 8.73,55.56 10.31,57.46 17.3,57.46 18.25,56.51 20.79,56.51 IC9.5
N$26
  Bottom 0.813: R14.2 33.81,13.96 34.13,13.65 34.13,6.98 POWERLED.K
N$27  (1 unrouted)
N$28  (1 unrouted)
  Bottom 0.406: R38.2 78.26,68.89
N$29
  Bottom 0.406: R37.2 92.23,51.11 92.86,51.75 94.77,51.75 95.72,51.11 LED1.A
N$30  (1 unrouted)
N$31  (via drill 0.8)
  Top 0.406: v83.97,31.11 v84.29,34.6 | v75.4,5.07 v75.4,8.25
  Bottom 0.406: IC3.2 80.16,1.58 77.62,1.58 R43.1 76.35,5.07 v75.4,5.07 | R44.S 84.92,35.24 v84.29,34.6 | v83.97,31.11 83.97,29.2 84.29,28.89 84.29,23.81 83.97,23.49 78.89,23.49 77.94,22.54 77.94,15.24 78.58,14.6 79.53,14.6 80.16,13.96 80.16,8.88 79.53,8.25 v75.4,8.25
N$32  (1 unrouted)
  Bottom 0.406: R44.A 99.21,45.4 JP1.3
  Bottom 0.813: JP1.3 JP1.2 JP1.1
N$33  (1 unrouted)
N$35  (via drill 0.8)
  Top 0.406: v39.2,53.97 v42.7,53.97
  Bottom 0.305: 33.17,55.24 32.54,55.24 30.63,57.14 30,57.46
  Bottom 0.406: R39.S 47.14,52.38 46.19,51.43 43.02,51.43 42.7,51.75 v42.7,53.97 | v39.2,53.97 35.39,53.97 34.44,54.92 33.17,55.24 | 30,57.46 26.82,57.46 26.82,61.27 IC9.26
N$36
  Bottom 0.813: LED4.K 35.39,6.03 35.39,14.6 34.13,15.87 R49.2
N$37
  Bottom 0.813: C22.1 SW2.5
N$38
  Bottom 0.813: C21.1 SW2.4
N$39
  Bottom 0.813: C20.1 SW2.3
N$40
  Bottom 0.813: C19.1 SW2.2
N$41
  Bottom 0.813: C18.1 SW2.1
N$42
  Bottom 0.813: C27.1 SW3.5
N$43
  Bottom 0.813: C26.1 SW3.4
N$44
  Bottom 0.813: C25.1 SW3.3
N$45
  Bottom 0.813: C24.1 SW3.2
N$46
  Bottom 0.813: C23.1 SW3.1
N$47
  Bottom 0.813: C32.1 SW4.5
N$48
  Bottom 0.813: C31.1 SW4.4
N$49
  Bottom 0.813: C30.1 SW4.3
N$50
  Bottom 0.813: C29.1 SW4.2
N$51
  Bottom 0.813: C28.1 SW4.1
N$52  (1 unrouted)
  Bottom 0.406: R50.1 95.4,2.22 95.08,1.58 92.55,1.58 IC3.6
N$53
  Bottom 0.406: JP3.3 99.21,62.86 R51.A | IC3.7 94.13,6.35 96.99,8.57 96.99,9.84 98.58,11.11 100.8,11.11 101.12,11.43 101.12,57.14 JP3.1
  Bottom 0.813: JP3.3 JP3.2 JP3.1
N$54
  Bottom 0.406: R52.S 80.48,56.19 96.67,56.19 JP4.3 | JP4.1 99.21,47.62 98.89,47.3 92.86,47.3 92.23,46.67 92.23,39.68 91.59,39.05 77.94,39.05 76.99,38.09 76.99,33.97 82.07,33.97 82.39,34.28 82.39,36.51 83.02,37.14 96.04,37.14 96.67,36.51 96.67,34.28 97.31,33.33 97.31,30.47 96.99,30.16 87.78,30.16 87.78,9.84 87.15,9.2 86.51,9.2 86.19,8.88 86.19,7.3 86.51,6.98 88.42,6.98 89.05,6.35 IC3.5
  Bottom 0.813: JP4.3 JP4.2 JP4.1
N$55
  Bottom 0.406: IC3.9 R53.1 91.59,17.14 R54.S
N$56
  Bottom 0.406: IC3.8 94.13,13.01 92.86,14.28 92.86,16.82 93.5,18.09 93.5,20.63 98.89,20.63 99.21,20.95 JP5.1 | R54.A 99.21,27.93 JP5.3
  Bottom 0.813: JP5.3 JP5.2 JP5.1
N$57  (via drill 0.8, 0.9)
  Top 0.406: v82.7,8.25 v87.78,8.25 | v89.05,8.25 v94.13,8.25
  Bottom 0.406: JP6.1 97.94,12.7 97.94,11.74 96.99,10.79 95.4,10.79 95.4,9.2 95.08,8.88 v94.13,8.25 | R55.S 82.07,17.77 82.7,17.14 v82.7,8.25 | v87.78,8.25 v89.05,8.25 IC3.10
  Bottom 0.813: JP6.3 JP6.2 JP6.1
N$58
  Bottom 0.305: 85.24,30.79 84.92,30.16 84.92,28.89 85.24,28.57 85.24,23.17
  Bottom 0.406: IC3.13 R56.1 81.43,15.87 80.8,16.5 79.53,16.5 79.21,16.82 79.21,21.58 80.16,22.54 84.61,22.54 85.24,23.17 | 85.24,30.79 94.45,30.79 94.77,31.11 94.77,33.65 92.55,33.65 92.23,33.33 76.03,33.33 76.03,38.73 77.3,40 90.64,40 91.28,40.63 91.28,47.3 92.23,48.25 96.67,48.25 96.99,48.57 96.99,53.97 96.04,54.92 82.39,54.92 82.39,51.11 78.89,51.11 78.89,57.46 92.55,57.46 93.18,58.1 93.18,65.72 93.5,66.04 96.99,66.04 97.31,66.35 97.31,69.84 96.99,70.16 R57.S
N$59  (via drill 0.8)
  Top 0.406: v86.19,29.52 v86.19,64.45 | v91.59,64.45 v94.45,64.45
  Bottom 0.305: 80.48,71.43 85.24,71.43 85.56,71.12 87.15,71.12 87.78,71.75 99.21,71.75 JP8.3
  Bottom 0.406: v94.45,64.45 98.89,64.45 99.21,64.77 JP8.1 | 80.48,71.43 R58.S | IC3.12 84.92,11.11 85.24,11.43 85.24,18.09 85.56,18.73 86.19,18.73 v86.19,29.52 | v86.19,64.45 v91.59,64.45
  Bottom 0.813: JP8.3 JP8.2 JP8.1
N$61
  Bottom 0.813: IC3.4 86.51,5.07 85.56,5.71 84.29,6.66 74.45,6.66 73.5,5.71 38.89,5.71 38.25,6.35 38.25,8.88 38.89,9.52 38.89,11.11 38.25,11.74 38.25,16.19 35.71,18.73 32.86,18.73 32.86,23.49 32.22,24.12 JP9.2
N$62
  Bottom 0.406: SW1.6 72.54,45.4 R35.E | R45.1 49.05,36.51 57.62,36.51 57.94,36.82 57.94,43.49 60.16,45.71 SW1.10
  Bottom 0.813: SW1.10 SW1.9 SW1.8 SW1.7 SW1.6
N$63
  Bottom 0.305: SW2.10 62.38,62.54
  Bottom 0.406: 62.38,62.54 R46.1 | SW2.6 72.54,62.86 R52.E
  Bottom 0.813: SW2.10 SW2.9 SW2.8 SW2.7 SW2.6
N$65
  Bottom 0.406: SW4.6 73.5,79.69 74.45,80.32 R58.E | 62.06,79.69 SW4.10 21.11,79.69 R48.1
  Bottom 0.813: SW4.10 SW4.9 SW4.8 SW4.7 SW4.6
N$68  (via drill 0.9)
  Top 0.406: v41.74,33.33 v60.16,33.33
  Bottom 0.406: v60.16,33.33 60.16,27.93 60.8,27.3 SW3.10 | R47.1 v41.74,33.33 | SW3.6 72.54,27.93 R55.E
  Bottom 0.813: SW3.10 SW3.9 SW3.8 SW3.7 SW3.6
N$69
  Bottom 0.813: 10.31,21.58 X3.1 | 10.31,21.58 12.85,21.58 14.12,20.31 14.12,13.33 J1.3 | S1.2 7.14,6.35 6.5,6.98 5.23,6.98 2.06,10.16 2.06,26.66 3.96,28.57 9.04,28.57 10.31,27.3 10.31,21.58
N$70
  Bottom 0.813: J1.2 11.58,9.52 6.5,9.52 3.33,12.06 3.33,24.12 5.23,26.03 X3.2
N$71
  Bottom 0.813: D3.A 13.35,5.46 12.06,5.46 11.73,5.45 S1.3
N$72  (1 unrouted)
N$73  (via drill 0.9)
  Top 0.406: v43.02,62.86 v43.02,73.02 | v36.35,57.14 v44.92,57.14
  Bottom 0.406: R23.2 R31.2 32.22,58.41 32.86,58.41 33.49,57.78 33.49,56.19 33.81,55.88 35.39,55.88 36.03,56.51 36.03,56.83 v36.35,57.14 | v43.02,73.02 52.86,73.02 53.17,72.7 R30.1 | v44.92,57.14 44.6,57.46 43.33,57.46 43.02,57.78 v43.02,62.86
N$75
  Bottom 0.406: IC9.9 16.98,46.03 Q1.2 15.07,47.3 C15.2
N$76
  Bottom 0.406: IC9.10 16.66,43.49 Q1.1 15.07,39.68 C14.1
N$101
  Bottom 0.406: IC9.21 C6.2
PWM
  Bottom 0.406: IC9.15 30.95,33.33 31.9,32.06 37.3,32.06 38.25,30.79 R47.2
R2R1_1
  Bottom 0.406: R8.1 IC1.4
R2R1_2
  Bottom 0.406: R7.1 32.86,44.45 33.17,44.76 34.13,44.76 34.44,45.08 IC1.5
R2R1_3
  Bottom 0.406: R6.1 34.44,41.91 35.08,42.54 IC1.6
R2R1_4
  Bottom 0.406: R5.1 35.08,39.37 35.71,40 IC1.7
R2R1_5
  Bottom 0.406: IC1.14 R4.1
R2R1_6
  Bottom 0.406: IC1.13 R3.1
R2R1_7
  Bottom 0.406: R2.1 IC1.12
R2R1_8
  Bottom 0.406: IC1.11 R1.1
R2R1_OUT
  Bottom 0.406: R9.2 56.98,46.67 55.71,46.35 55.71,40 R1.2
  Bottom 0.61: R45.2 R1.2
R2R2_1
  Bottom 0.406: R26.1 IC2.4
R2R2_2
  Bottom 0.406: R25.1 IC2.5
R2R2_3
  Bottom 0.406: R24.1 IC2.6
R2R2_4
  Bottom 0.406: R23.1 IC2.7
R2R2_5
  Bottom 0.406: IC2.14 R22.1
R2R2_6
  Bottom 0.406: IC2.13 46.19,70.48 50.63,70.48 51.27,69.84 R21.1
R2R2_7
  Bottom 0.406: IC2.12 R20.1
R2R2_8
  Bottom 0.406: IC2.11 R19.1
R2R2_OUT
  Bottom 0.406: R46.2 57.3,64.77 57.3,65.72 R27.2 54.13,64.77 52.54,64.45 52.22,64.13 R19.2
STROBE  (via drill 0.9)  (1 unrouted)
  Top 0.406: v39.84,73.02 v39.84,76.51
  Bottom 0.406: IC1.1 38.89,55.24 39.2,55.56 39.2,59.37 38.89,60 38.89,60.64 39.2,61.27 39.2,69.21 39.52,69.53 40.79,69.53 41.43,70.16 41.43,71.43 40.79,72.07 v39.84,73.02 | IC2.1 39.52,76.83 v39.84,76.51
TASTER1  (via drill 0.9)
  Top 0.406: v13.17,56.19 v13.17,64.77 | v13.49,70.16 v31.27,70.16
  Bottom 0.406: T1.1 39.84,8.88 39.84,12.06 39.2,12.7 39.2,17.14 36.35,20 33.81,20 33.81,28.25 33.17,28.89 23.33,28.89 23.01,29.2 23.01,54.6 22.7,54.92 19.52,54.92 18.88,55.56 13.49,55.56 v13.17,56.19 | v13.17,64.77 13.17,70.16 v13.49,70.16 | IC9.28 29.68,66.35 30.95,67.62 30.95,68.58 31.27,68.89 v31.27,70.16
VCC  (via drill 0.9, 1.1)  (1 unrouted)
  Top 0.406: v14.12,53.02 v16.34,64.13 | v35.08,17.14 v37.94,27.62 | v58.57,66.04 v58.57,61.91
  Top 0.813: v32.54,10.16 v36.98,10.16 | v50,80.96 v50,76.83 | v58.57,80.96 v58.57,76.83
  Bottom 0.305: 3.01,80.64 3.33,80.64 3.33,80.96
  Bottom 0.406: IC9.7 18.57,51.11 C16.2 16.66,50.8 16.66,51.75 16.03,52.38 14.44,52.38 14.12,52.7 v14.12,53.02 | IC9.20 C17.2 | D2.C 22.38,68.26 23.01,67.62 23.01,65.08 16.34,65.08 | v16.34,64.13 16.34,65.08 | 16.34,65.08 R13.2 15.39,65.72 14.76,66.35 14.76,68.89 15.71,69.84 17.3,69.84 17.61,70.48 17.61,74.61 18.25,75.24 19.52,75.24 JP13.2 | R41.A 56.67,26.66 56.35,26.35 45.87,26.35 45.24,26.98 R42.A 43.97,26.35 38.89,26.35 v37.94,27.62 | 52.54,55.24 C1.2 | 52.54,55.24 53.49,56.19 53.49,61.59 54.45,62.54 R39.A 56.98,61.91 v58.57,61.91 | v58.57,76.83 v58.57,66.04 | 52.54,55.24 53.49,54.29 57.62,54.29 58.26,53.65 58.26,46.03 R40.A | 3.33,80.64 3.65,80.96 v50,80.96
  Bottom 0.813: D1.A C5.1 28.41,2.85 POWERLED.A 29.36,4.44 30.63,5.07 31.9,6.35 31.9,8.25 | IC8.3 26.19,7.62 27.46,8.25 29.36,8.25 C13.+ 30,8.25 31.9,8.25 | 31.9,8.25 32.54,8.88 v32.54,10.16 32.54,12.7 20.47,12.7 20.47,18.73 19.2,20 19.2,22.22 18.25,23.17 15.39,23.17 13.49,25.08 13.49,31.11 10.63,33.97 7.14,33.97 6.5,34.6 X1.2 X1.3 6.5,43.17 3.96,45.71 3.96,53.34 | LED4.A 36.98,4.44 v36.98,10.16 36.98,15.24 v35.08,17.14 31.59,17.46 31.59,21.58 JP9.1 | IC2.15 IC2.16 C2.2 v50,76.83 | C1.2 IC1.16 IC1.15 | 3.96,53.34 4.6,53.97 13.49,53.97 v14.12,53.02 | 3.96,53.34 3.01,53.97 2.38,53.97 1.42,54.6 1.42,79.37 3.01,80.64 | v50,80.96 v58.57,80.96

### Text on the board
Bottom: 2008 | fw